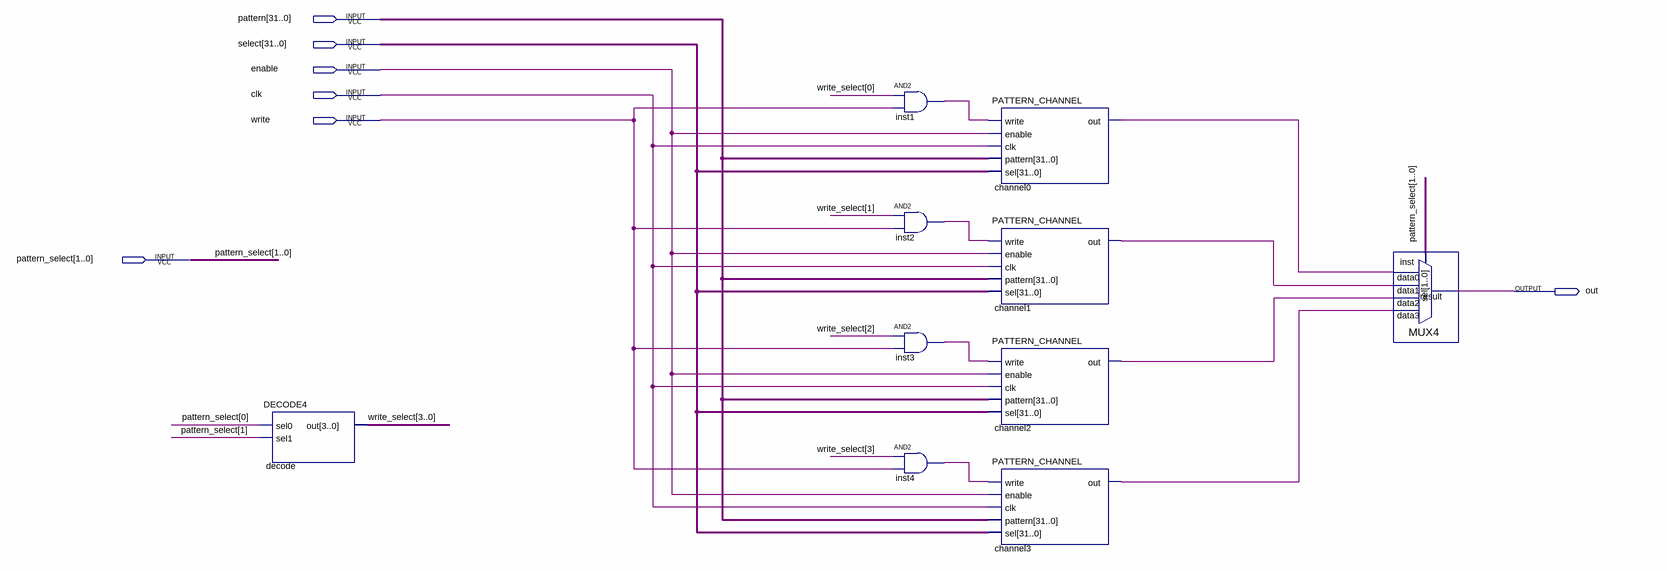
[diagram p0: schematic sheet]
// Quartus schematic CHANNEL4.bdf as structural Verilog: 10 symbols, 7 pins
module CHANNEL4 (
  input  [31:0] pattern,
  input  [31:0] select,
  input  enable,
  input  clk,
  input  write,
  input  [1:0] pattern_select,
  output out
);

  wire channel0_out, channel1_out, channel2_out, channel3_out, inst1_out, inst2_out, inst3_out, inst4_out;
  wire [3:0] write_select;

  DECODE4 decode (.sel0(pattern_select[0]), .sel1(pattern_select[1]), .out(write_select));
  and inst1 (inst1_out, write_select[0], write);
  and inst2 (inst2_out, write_select[1], write);
  and inst3 (inst3_out, write_select[2], write);
  and inst4 (inst4_out, write_select[3], write);
  PATTERN_CHANNEL channel0 (
    .write(inst1_out), .enable(enable), .clk(clk), .pattern(pattern), .sel(select), .out(channel0_out));
  PATTERN_CHANNEL channel1 (
    .write(inst2_out), .enable(enable), .clk(clk), .pattern(pattern), .sel(select), .out(channel1_out));
  PATTERN_CHANNEL channel2 (
    .write(inst3_out), .enable(enable), .clk(clk), .pattern(pattern), .sel(select), .out(channel2_out));
  PATTERN_CHANNEL channel3 (
    .write(inst4_out), .enable(enable), .clk(clk), .pattern(pattern), .sel(select), .out(channel3_out));
  MUX4 inst (
    .data3(channel3_out), .data2(channel2_out), .data1(channel1_out), .data0(channel0_out),
    .sel(pattern_select), .result(out));
endmodule
